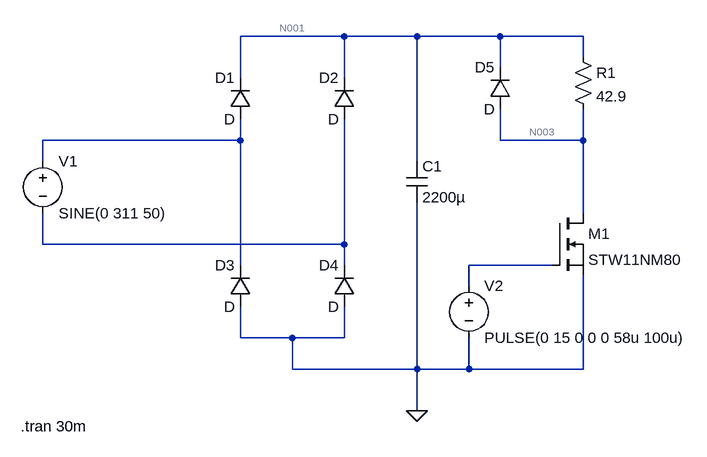
[diagram p0: schematic Control de motor CC.asc]
Control de motor CC.asc, the LTspice schematic file:
Version 4
SHEET 1 936 680
WIRE 304 -240 144 -240
WIRE 416 -240 304 -240
WIRE 544 -240 416 -240
WIRE 672 -240 544 -240
WIRE 672 -208 672 -240
WIRE 544 -192 544 -240
WIRE 144 -176 144 -240
WIRE 304 -176 304 -240
WIRE 144 -80 144 -112
WIRE 144 -80 -160 -80
WIRE 544 -80 544 -128
WIRE 672 -80 672 -128
WIRE 672 -80 544 -80
WIRE -160 -48 -160 -80
WIRE 416 -48 416 -240
WIRE 672 32 672 -80
WIRE -160 80 -160 32
WIRE 304 80 304 -112
WIRE 304 80 -160 80
WIRE 144 112 144 -80
WIRE 304 112 304 80
WIRE 624 112 496 112
WIRE 496 144 496 112
WIRE 144 224 144 176
WIRE 224 224 144 224
WIRE 304 224 304 176
WIRE 304 224 224 224
WIRE 224 272 224 224
WIRE 416 272 416 16
WIRE 416 272 224 272
WIRE 496 272 496 224
WIRE 496 272 416 272
WIRE 672 272 672 128
WIRE 672 272 496 272
WIRE 416 336 416 272
FLAG 416 336 0
SYMBOL nmos 624 32 R0
SYMATTR InstName M1
SYMATTR Value STW11NM80
SYMBOL res 656 -224 R0
SYMATTR InstName R1
SYMATTR Value 42.9
SYMBOL diode 160 -112 R180
WINDOW 0 24 64 Left 2
WINDOW 3 24 0 Left 2
SYMATTR InstName D1
SYMBOL diode 320 -112 R180
WINDOW 0 24 64 Left 2
WINDOW 3 24 0 Left 2
SYMATTR InstName D2
SYMBOL diode 160 176 R180
WINDOW 0 24 64 Left 2
WINDOW 3 24 0 Left 2
SYMATTR InstName D3
SYMBOL diode 320 176 R180
WINDOW 0 24 64 Left 2
WINDOW 3 24 0 Left 2
SYMATTR InstName D4
SYMBOL voltage -160 -64 R0
WINDOW 123 0 0 Left 2
WINDOW 39 0 0 Left 2
SYMATTR InstName V1
SYMATTR Value SINE(0 311 50)
SYMBOL voltage 496 128 R0
WINDOW 123 0 0 Left 2
WINDOW 39 0 0 Left 2
SYMATTR InstName V2
SYMATTR Value PULSE(0 15 0 0 0 58u 100u)
SYMBOL diode 560 -128 R180
WINDOW 0 24 64 Left 2
WINDOW 3 24 0 Left 2
SYMATTR InstName D5
SYMBOL cap 400 -48 R0
SYMATTR InstName C1
SYMATTR Value 2200µ
TEXT -194 360 Left 2 !.tran 30m

The netlist it stands for:
* Control de motor CC.asc
M1 N003 N005 0 0 STW11NM80
R1 N001 N003 42.9
D1 N002 N001 D
D2 N004 N001 D
D3 0 N002 D
D4 0 N004 D
V1 N002 N004 SINE(0 311 50)
V2 N005 0 PULSE(0 15 0 0 0 58u 100u)
D5 N003 N001 D
C1 N001 0 2200µ
.model D D
.lib standard.dio
.model NMOS NMOS
.model PMOS PMOS
.lib standard.mos
.tran 30m
.backanno
.end

* Results of the author's LTspice run, read from the files saved beside the schematic
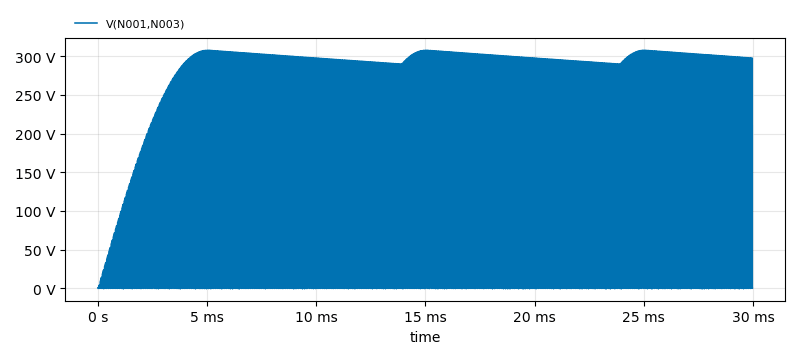
[diagram p1: Transient Analysis of Control de motor CC.asc, plotted from the saved traces]
* Transient Analysis, 1 run:
*   V(N001,N003): min -714.4 mV, max 307.5 V, average 181.1 V, rms 230.1 V, last 0 V